# EAGLE design Sumo_sensors (EAGLE 6.5.0)
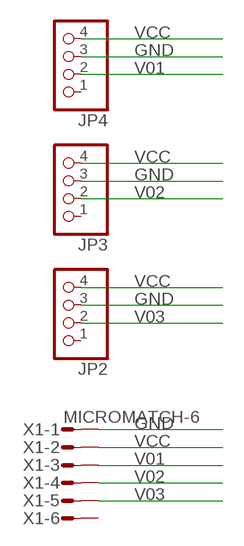
[diagram p0: schematic, sheet 1]

## Parts
JP2  PINHD-1X4  [1X04]
JP3  PINHD-1X4  [1X04]
JP4  PINHD-1X4  [1X04]
X1  MICROMATCH-6  [MICROMATCH-6]

## Nets
GND: JP2.3 JP3.3 JP4.3 X1.1
V01: JP4.2 X1.3
V02: JP3.2 X1.4
V03: JP2.2 X1.5
VCC: JP2.4 JP3.4 JP4.4 X1.2
Unconnected: JP2.1 JP3.1 JP4.1 X1.6

## Library data of the parts
JP2-JP4 = pinhead:PINHD-1X4: PIN HEADER
X1 = con-amp-micromatch:MICROMATCH-6: MicroMaTch 6 7-215464-6 / 0-215464-6 Drawing Number C-215464 DDEController.pdf; MPN: 7-215464-6; OC_FARNELL: 3784630; OC_NEWARK: 19R8125

## Board
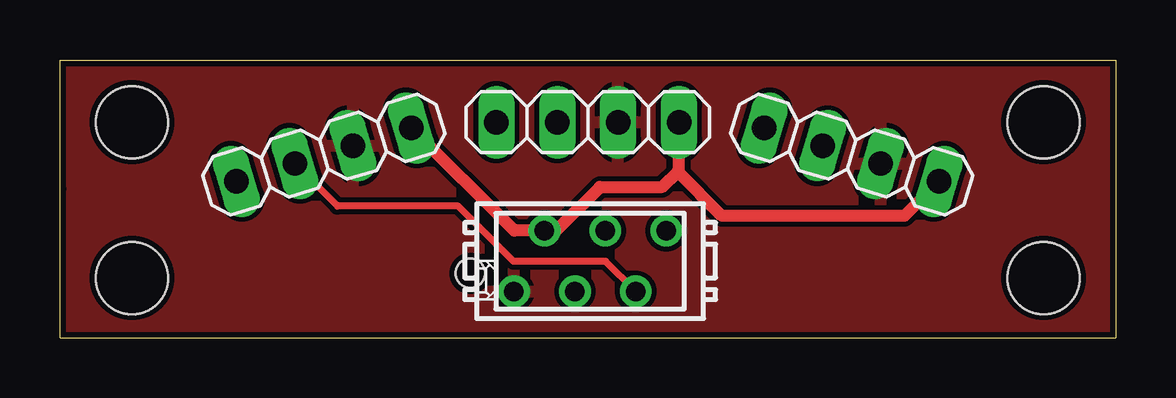
[diagram p1: board, top side]
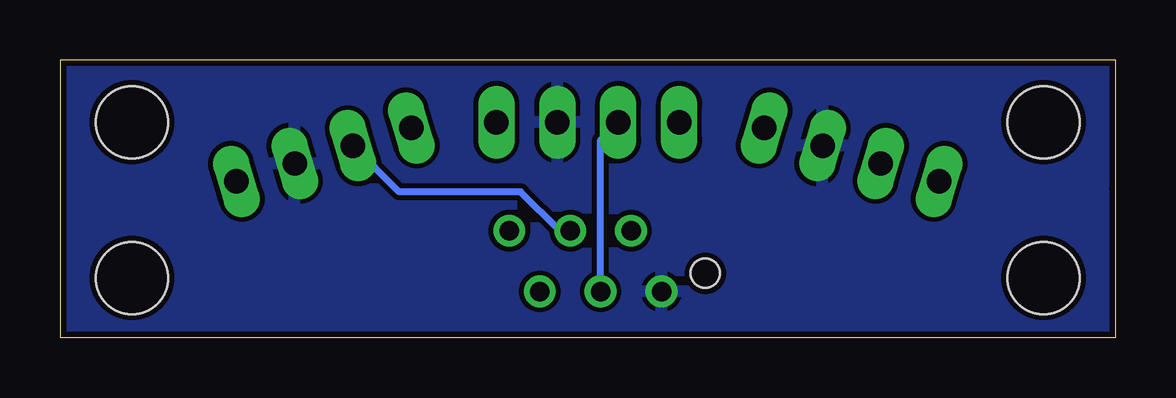
[diagram p2: board, bottom side, seen from below]

Size 44 x 11.6 mm. Coordinates in mm from the lower left corner, seen from the top.
Outline: 0,6.23 0.02,6.23
Outline: 0,0 44,0 44,11.6 0,11.6 0,0
Copper layers (1*16): Top 0.035mm / dielectric 1.5mm / Bottom 0.035mm
Design rules "SeeedStudio_2layer_DRU_modified": minimum track width 0.2mm, minimum drill 0.3mm, track to track 0.2mm, track to pad 0.2mm, pad to pad 0.2mm, via to via 0.2mm, smd to smd 0mil, copper to edge 10mil, drill to drill 10mil, minimum pad ring 10mil, minimum via ring 6mil, stop-mask expansion 2mil, vias tented up to drill 100mil, thermal gap 0.2mm
Holes 3 mm at 41,2.5 3,2.5 3,9 41,9
Holes 1.2 mm at 17.1,2.7

### Footprints (pad centres in the part's own frame; a part is rotated, then mirrored left to right if it is on the bottom)
1X04 = drill 1.016 long: 1 -3.81,0; 2 -1.27,0; 3 1.27,0; 4 3.81,0
MICROMATCH-6 = drill 0.813: 1 3.175,1.27; 2 1.905,-1.27; 3 0.635,1.27; 4 -0.635,-1.27; 5 -1.905,1.27; 6 -3.175,-1.27

### Placement (x,y rotation side)
JP2  11,7.65 17 top
JP3  33,7.65 343 top
JP4  22,9 0 top
X1  22.1,3.21 180 top

### Tracks (layer width: path | path; a pad name or v marks a point on that pad's centre or on a via)
GND
  pour Top: 0,0 0,11.6 44,11.6 44,0
  pour Bottom: 0,0 0,11.6 44,11.6 44,0
V01
  Bottom 0.3: X1.3 21.46,8.27 JP4.2
V02
  Bottom 0.3: X1.4 23.18,4.48 24.8,6.1 29.86,6.1 JP3.2
V03
  Top 0.3: X1.5 22.75,3.2 18.9,3.2 16.6,5.5 11.56,5.5 JP2.2
VCC
  Top 0.5: JP2.4 18.93,4.48 X1.2 20.68,4.48 22.5,6.3 25.1,6.3 25.75,6.95 | 25.75,6.95 25.8,7 JP4.4 | JP3.4 35.21,5.1 27.6,5.1 25.75,6.95